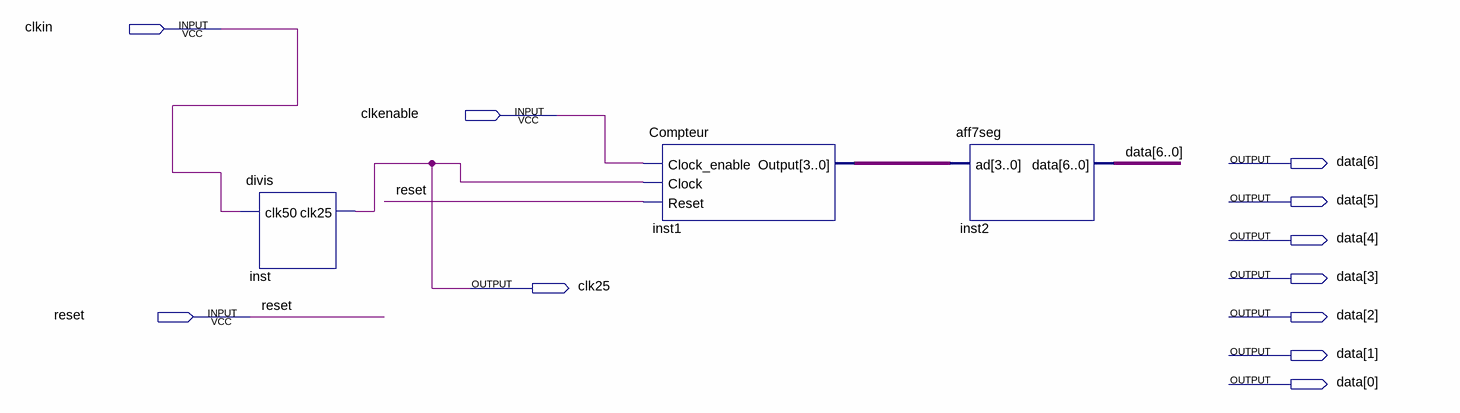
[diagram p0: schematic sheet]
// Quartus schematic Projet.bdf as structural Verilog: 3 symbols, 11 pins
module Projet (
  input  clkin,
  input  clkenable,
  input  reset,
  output [6:0] data,
  output clk25
);

  wire [3:0] inst1_output;

  divis inst (.clk50(clkin), .clk25(clk25));
  Compteur inst1 (.Clock_enable(clkenable), .Clock(clk25), .Reset(reset), .Output(inst1_output));
  aff7seg inst2 (.ad(inst1_output), .data(data));
endmodule
